# Altium schematic sheet Controller.SchDoc: Payload Card Output Control
size A3; Revision: 1A; SheetNumber: 3; SheetTotal: 6; Organization: Brickworks; Address1: Matthew Glazer; Address2: Design Engineer
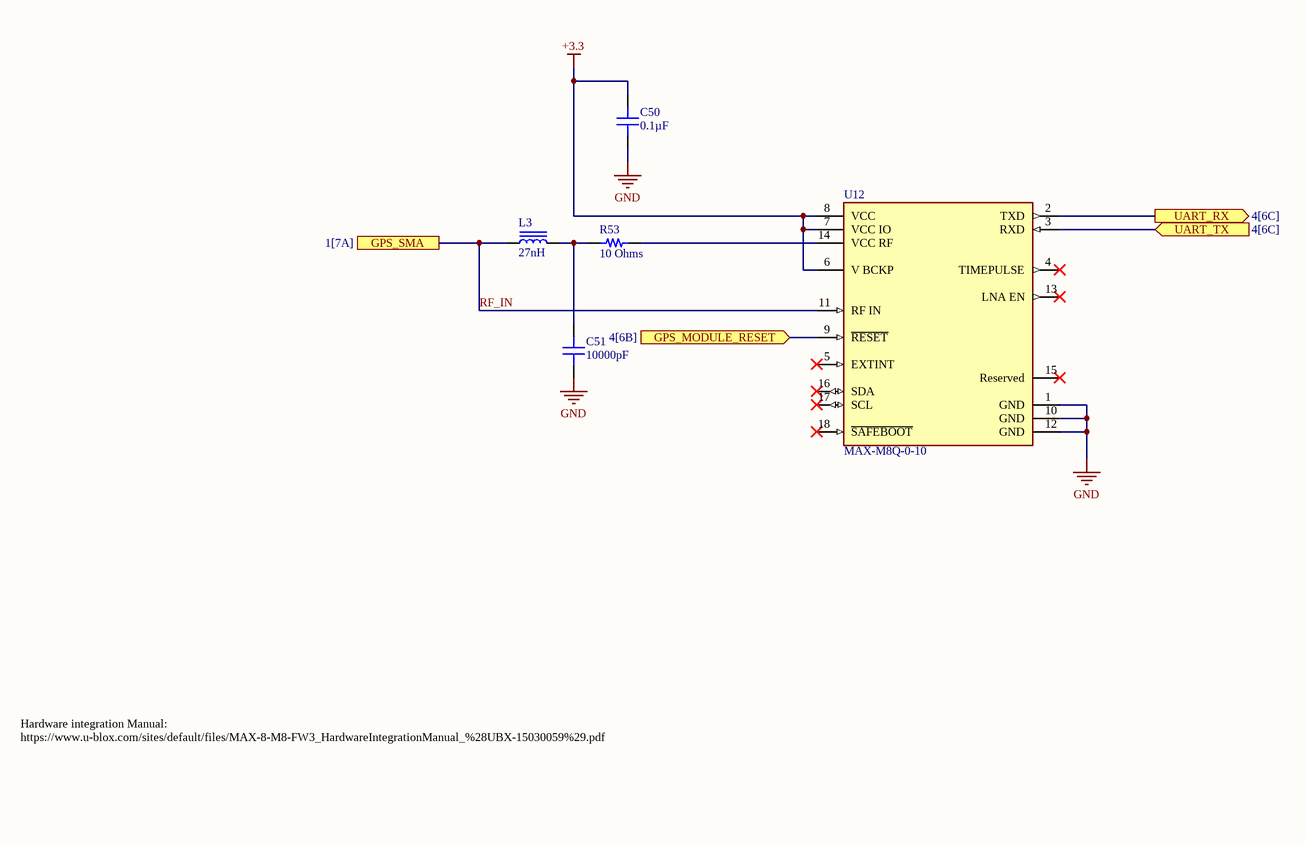
[diagram p0: Controller.SchDoc]

## Parts
C50  0.1µF  [CAP 0603_1608]
C51  10000pF  [CAP 0603_1608]
L3  27nH  [IND 0402_1005 RF WW]
R53  10 Ohms  [RES 0603_1608]
U12  MAX-M8Q-0-10  [FP-MAX-M8Q-0-10-MFG]

## Ports
GPS_MODULE_RESET (in, see 4[6B]), GPS_SMA (see 1[7A]), UART_RX (out, see 4[6C]), UART_TX (in, see 4[6C])

## Nets
+3.3: C50.1 U12.6(V_BCKP) U12.7(VCC_IO) U12.8(VCC)
GND: C50.2 C51.1 U12.1(GND) U12.10(GND) U12.12(GND)
GPS_MODULE_RESET: U12.9(~{RESET}) ; port GPS_MODULE_RESET
RF_IN: L3.1 U12.11(RF_IN) ; port GPS_SMA
UART_RX: U12.2(TXD) ; port UART_RX
UART_TX: U12.3(RXD) ; port UART_TX
NetC51_2: C51.2 L3.2 R53.2
NetR53_1: R53.1 U12.14(VCC_RF)

Not connected (* = marked no-connect by the designer): U12 4(TIMEPULSE)* 5(EXTINT)* 13(LNA_EN)* 15(Reserved)* 16(SDA)* 17(SCL)* 18(~{SAFEBOOT})*

## Notes on the sheet
- Hardware integration Manual:
  https://www.u-blox.com/sites/default/files/MAX-8-M8-FW3_HardwareIntegrationManual_%28UBX-15030059%29.pdf
- Title
- Size:
- Date:
- A3
- Number:
- Time:
- Revision:
- Sheet
- of
- File:

## Library data of the parts
C50 = CL10B104KA8WPNC: CAP CER 0.1UF 25V X7R 0603; Manufacturer: Samsung Electro-Mechanics; Tolerance: ±10%; Part Number: CL10B104KA8WPNC; Value: 0.1µF; Applications: Automotive; Capacitance: 0.1µF; ComponentLink1Description: Datasheet; ComponentLink1URL: http://www.samsungsem.com/kr/support/product-search/mlcc/CL10B104KA8WPNC.jsp; ComponentLink2Description: DigiKey Link; ComponentLink2URL: http://digikey.com/product-detail/en/samsung-electro-mechanics/CL10B104KA8WPNC/1276-6717-1-ND/5961576; Device Package: 0603 (1608 Metric); Features: Open Mode; LastUpdated: 9/2/2020 1:03:30 AM; Lifecycle Status: Active; Minimum Order: 1; Mounting Type: Surface Mount, MLCC; Operating Temperature: -55°C ~ 125°C; Package / Case: 0603 (1608 Metric); Packaging: TapeAndReel; PartId: 5631; Part Status: Active; Price: 0.02; Ratings: AEC-Q200; Series: CL; Size / Dimension: 0.063" L x 0.031" W (1.60mm x 0.80mm); Supplier 1: DigiKey; Supplier Part Number 1: 1276-6717-1-ND; Temperature Coefficient: X7R; Thickness (Max): 0.035" (0.90mm); Voltage - Rated: 25V
C51 = C0603S103K4RACTU: CAP CER 10000PF 16V X7R 0603; Manufacturer: KEMET; Tolerance: ±10%; Part Number: C0603S103K4RACTU; Value: 10000pF; Applications: Boardflex Sensitive; Capacitance: 10000pF; ComponentLink1Description: Datasheet; ComponentLink1URL: https://api.kemet.com/component-edge/download/datasheet/C0603S103K4RACTU.pdf; ComponentLink2Description: DigiKey Link; ComponentLink2URL: http://digikey.com/product-detail/en/kemet/C0603S103K4RACTU/399-9135-1-ND/3522653; Device Package: 0603 (1608 Metric); Features: Floating Electrode; LastUpdated: 9/2/2020 1:03:34 AM; Lifecycle Status: Active; Minimum Order: 1; Mounting Type: Surface Mount, MLCC; Operating Temperature: -55°C ~ 125°C; Package / Case: 0603 (1608 Metric); Packaging: TapeAndReel; PartId: 3312; Part Status: Active; Price: 0.07; Series: SMD Comm X7R FE; Size / Dimension: 0.063" L x 0.031" W (1.60mm x 0.80mm); Supplier 1: DigiKey; Supplier Part Number 1: 399-9135-1-ND; Temperature Coefficient: X7R; Thickness (Max): 0.034" (0.87mm); Voltage - Rated: 16V
L3 = LQW15AN27NG00D: FIXED IND 27NH 280MA 520 MOHM; Manufacturer: Murata Electronics; DC Resistance (DCR): 520mOhm Max; Frequency - Self Resonant: 3.5GHz; Inductance Frequency - Test: 100MHz; Material - Core: Non-Magnetic; Q @ Freq: 25 @ 250MHz; Shielding: Unshielded; Tolerance: ±2%; Type: Wirewound; Part Number: LQW15AN27NG00D; ComponentLink1Description: Datasheet; ComponentLink1URL: https://search.murata.co.jp/Ceramy/image/img/P02/JELF243A-0050.pdf; ComponentLink2Description: DigiKey Link; ComponentLink2URL: http://digikey.com/product-detail/en/murata-electronics/LQW15AN27NG00D/490-6792-1-ND/3845989; Current Rating (Amps): 280mA; Device Package: 0402 (1005 Metric); Height - Seated (Max): 0.024" (0.60mm); Inductance: 27nH; LastUpdated: 9/2/2020 1:22:25 AM; Lifecycle Status: Active; Minimum Order: 1; Mounting Type: Surface Mount; Operating Temperature: -55°C ~ 125°C; Package / Case: 0402 (1005 Metric); Packaging: TapeAndReel; PartId: 480; Part Status: Active; Price: 0.05; Series: LQW15; Size / Dimension: 0.039" L x 0.020" W (1.00mm x 0.50mm); Supplier 1: DigiKey; Supplier Part Number 1: 490-6792-1-ND; Value: 27nH
R53 = CRGCQ0603F10R: CRGCQ 0603 10R 1%; Manufacturer: TE Connectivity Passive Product; Power (Watts): 0.1W, 1/10W; Temperature Coefficient: ±400ppm/°C; Part Number: CRGCQ0603F10R; Value: 10 Ohms; ComponentLink1Description: Datasheet; ComponentLink1URL: https://www.te.com/commerce/DocumentDelivery/DDEController?Action=srchrtrv&DocNm=1773204-3&DocType=DS&DocLang=English; ComponentLink2Description: DigiKey Link; ComponentLink2URL: http://digikey.com/product-detail/en/te-connectivity-passive-product/CRGCQ0603F10R/A129664CT-ND/8577496; Composition: Thick Film; Device Package: 0603 (1608 Metric); Features: Automotive AEC-Q200, Moisture Resistant; Height - Seated (Max): 0.022" (0.55mm); LastUpdated: 9/2/2020 1:09:39 AM; Lifecycle Status: Active; Minimum Order: 1; Number of Terminations: 2; Operating Temperature: -55°C ~ 155°C; Package / Case: 0603 (1608 Metric); Packaging: CutTape; PartId: 23975; Part Status: Active; Price: 0.10; Ratings: AEC-Q200; Resistance: 10 Ohms; Series: CRGCQ; Size / Dimension: 0.063" L x 0.031" W (1.60mm x 0.80mm); Supplier 1: DigiKey; Supplier Part Number 1: A129664CT-ND; Supplier Device Package: 0603; Tolerance: ±1%
U12 = CMP-207130-000011-1: RF RCVR GNSS/GPS 1.575GHZ 18LCC; Manufacturer: u-blox; Max Supply Voltage: 3.6V; Automotive Grade: Grade 3; Nominal Supply Current: 5.7-26mA; Interface: I2C,UART; Sensitivity: -167dBm; Min Supply Voltage: 2.7V; Temperature Range Low: -40°C; Lead Free: Yes; RoHS: TRUE; Category: UNK; Manufacturer Part Number: MAX-M8Q-0; Footprint Url: https://www.u-blox.com/en/docs/UBX-15030059; ComponentLink2URL: https://www.u-blox.com/sites/default/files/MAX-M8-FW3_DataSheet_%28UBX-15031506%29.pdf; Temperature Range High: +85°C; Temperature: -40°C to +85°C; Octopart: https://octopart.com/max-m8q-0-u-blox-54356790; ComponentLink2Description: Datasheet; Automotive: Yes; Digikey Description: RF RCVR GNSS/GPS 1.575GHZ 18LCC; Height: 2.7mm; Package: 0; Device Class L2: RF Semiconductors and Devices; Device Class L3: RF Receivers; Device Class L1: Integrated Circuits (ICs)